# EAGLE design concentrator (EAGLE 9.6.0)
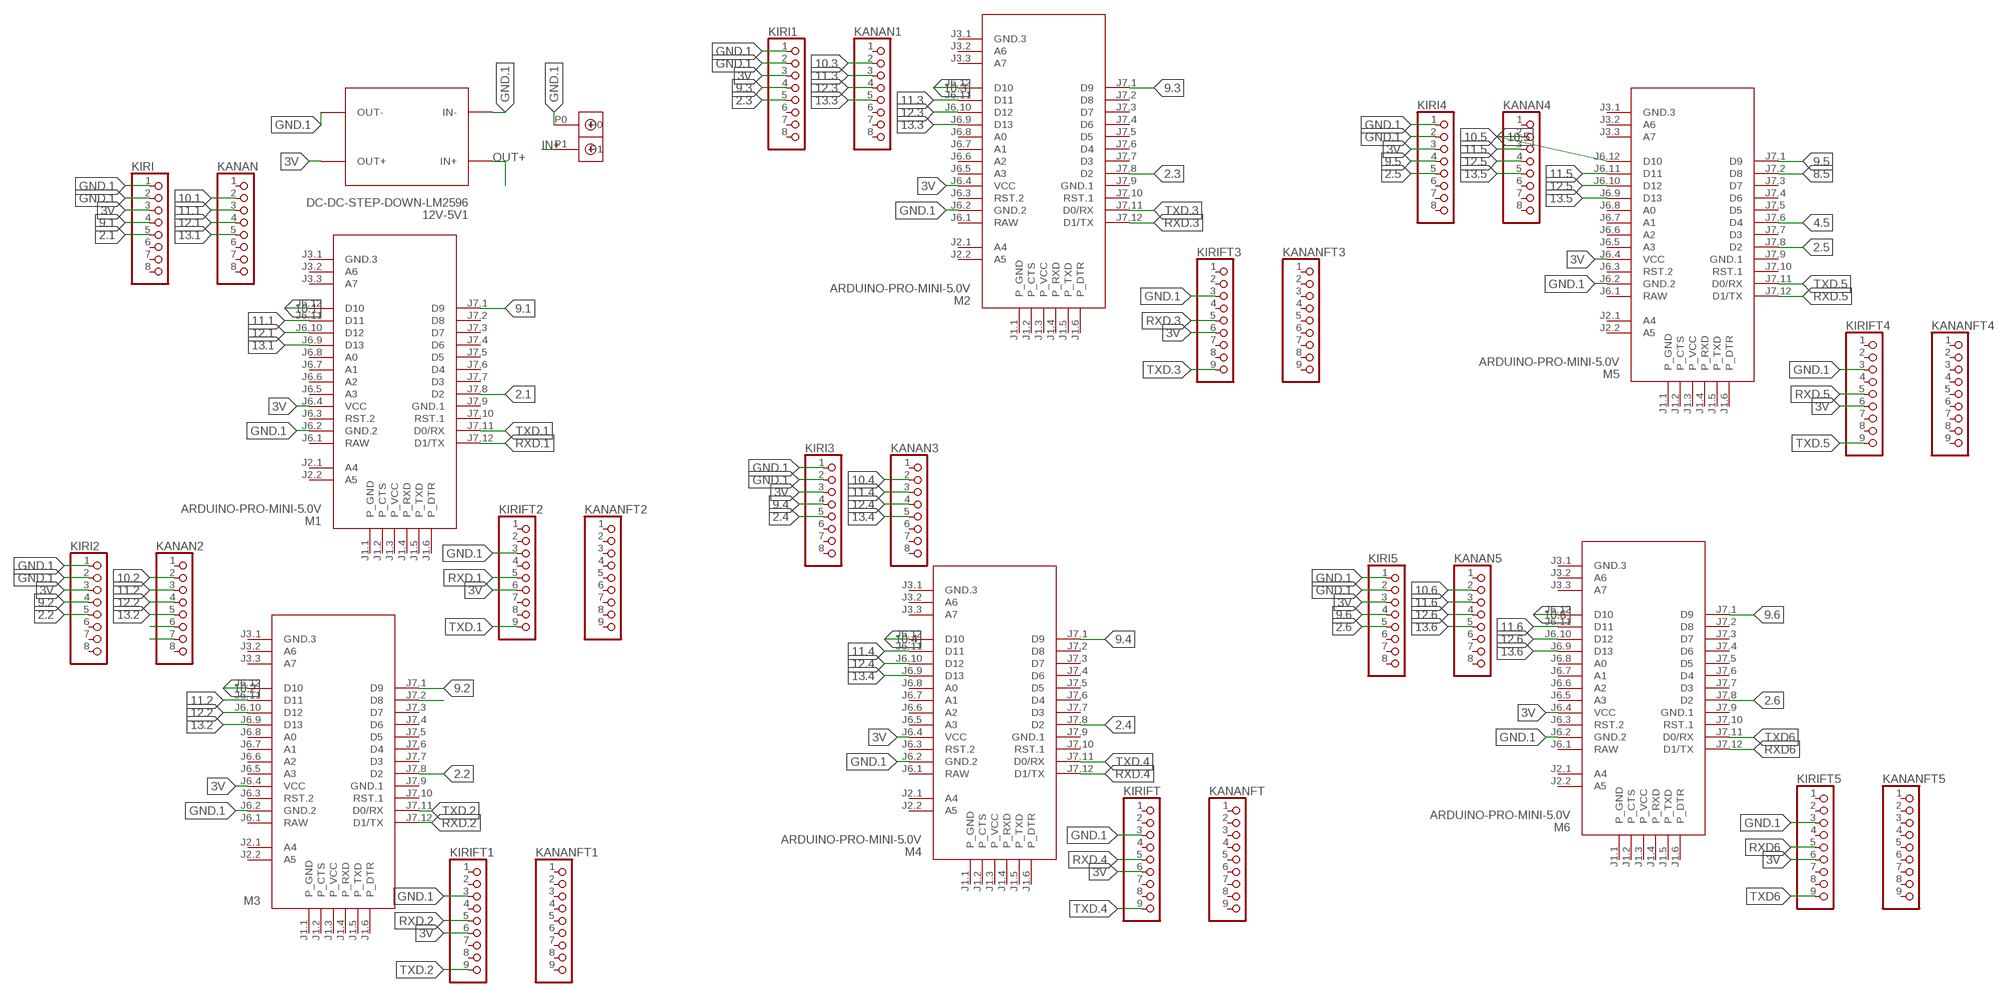
[diagram p0: schematic, sheet 1]

## Parts
12V-5V1  DC-DC-STEP-DOWN-LM2596  [DC-DC-STEP-DOWN-LM2596]
KANAN  PINHD-1X8  [1X08]
KANAN1  PINHD-1X8  [1X08]
KANAN2  PINHD-1X8  [1X08]
KANAN3  PINHD-1X8  [1X08]
KANAN4  PINHD-1X8  [1X08]
KANAN5  PINHD-1X8  [1X08]
KANANFT  PINHD-1X9  [1X09]
KANANFT1  PINHD-1X9  [1X09]
KANANFT2  PINHD-1X9  [1X09]
KANANFT3  PINHD-1X9  [1X09]
KANANFT4  PINHD-1X9  [1X09]
KANANFT5  PINHD-1X9  [1X09]
KIRI  PINHD-1X8  [1X08]
KIRI1  PINHD-1X8  [1X08]
KIRI2  PINHD-1X8  [1X08]
KIRI3  PINHD-1X8  [1X08]
KIRI4  PINHD-1X8  [1X08]
KIRI5  PINHD-1X8  [1X08]
KIRIFT  PINHD-1X9  [1X09]
KIRIFT1  PINHD-1X9  [1X09]
KIRIFT2  PINHD-1X9  [1X09]
KIRIFT3  PINHD-1X9  [1X09]
KIRIFT4  PINHD-1X9  [1X09]
KIRIFT5  PINHD-1X9  [1X09]
M1  ARDUINO-PRO-MINI-5.0V  [ARDUINO-PRO-MINI]
M2  ARDUINO-PRO-MINI-5.0V  [ARDUINO-PRO-MINI]
M3  ARDUINO-PRO-MINI-5.0V  [ARDUINO-PRO-MINI]
M4  ARDUINO-PRO-MINI-5.0V  [ARDUINO-PRO-MINI]
M5  ARDUINO-PRO-MINI-5.0V  [ARDUINO-PRO-MINI]
M6  ARDUINO-PRO-MINI-5.0V  [ARDUINO-PRO-MINI]
U$1  DBCONN-1X2  [DBCONN-1X2]

## Nets
2.1: KIRI.5 M1.J7.8(D2)
2.2: KIRI2.5 M3.J7.8(D2)
2.3: KIRI1.5 M2.J7.8(D2)
2.4: KIRI3.5 M4.J7.8(D2)
2.5: KIRI4.5 M5.J7.8(D2)
2.6: KIRI5.5 M6.J7.8(D2)
3V: 12V-5V1.OUT+ KIRI1.3 KIRI2.3 KIRI3.3 KIRI4.3 KIRI5.3 KIRI.3 KIRIFT1.6 KIRIFT2.6 KIRIFT3.6 KIRIFT4.6 KIRIFT5.6 KIRIFT.6 M1.J6.4(VCC) M2.J6.4(VCC) M3.J6.4(VCC) M4.J6.4(VCC) M5.J6.4(VCC) M6.J6.4(VCC)
4.5: M5.J7.6(D4)
8: M3.J7.2(D8)
8.5: M5.J7.2(D8)
9.1: KIRI.4 M1.J7.1(D9)
9.2: KIRI2.4 M3.J7.1(D9)
9.3: KIRI1.4 M2.J7.1(D9)
9.4: KIRI3.4 M4.J7.1(D9)
9.5: KIRI4.4 M5.J7.1(D9)
9.6: KIRI5.4 M6.J7.1(D9)
10.1: KANAN.2 M1.J6.12(D10)
10.2: KANAN2.2 M3.J6.12(D10)
10.3: KANAN1.2 M2.J6.12(D10)
10.4: KANAN3.2 M4.J6.12(D10)
10.5: KANAN4.2 M5.J6.12(D10)
10.6: KANAN5.2 M6.J6.12(D10)
11.1: KANAN.3 M1.J6.11(D11)
11.2: KANAN2.3 M3.J6.11(D11)
11.3: KANAN1.3 M2.J6.11(D11)
11.4: KANAN3.3 M4.J6.11(D11)
11.5: KANAN4.3 M5.J6.11(D11)
11.6: KANAN5.3 M6.J6.11(D11)
12.1: KANAN.4 M1.J6.10(D12)
12.2: KANAN2.4 M3.J6.10(D12)
12.3: KANAN1.4 M2.J6.10(D12)
12.4: KANAN3.4 M4.J6.10(D12)
12.5: KANAN4.4 M5.J6.10(D12)
12.6: KANAN5.4 M6.J6.10(D12)
13.1: KANAN.5 M1.J6.9(D13)
13.2: KANAN2.5 M3.J6.9(D13)
13.3: KANAN1.5 M2.J6.9(D13)
13.4: KANAN3.5 M4.J6.9(D13)
13.5: KANAN4.5 M5.J6.9(D13)
13.6: KANAN5.5 M6.J6.9(D13)
GND.1: 12V-5V1.IN- 12V-5V1.OUT- KIRI1.1 KIRI1.2 KIRI2.1 KIRI2.2 KIRI3.1 KIRI3.2 KIRI4.1 KIRI4.2 KIRI5.1 KIRI5.2 KIRI.1 KIRI.2 KIRIFT1.3 KIRIFT2.3 KIRIFT3.3 KIRIFT4.3 KIRIFT5.3 KIRIFT.3 M1.J6.2(GND.2) M2.J6.2(GND.2) M3.J6.2(GND.2) M4.J6.2(GND.2) M5.J6.2(GND.2) M6.J6.2(GND.2) U$1.P0
IN+: U$1.P1
N$15: KANAN2.6
N$19: KANAN2.7
OUT+: 12V-5V1.IN+
RXD6: KIRIFT5.5 M6.J7.12(D1/TX)
RXD.1: KIRIFT2.5 M1.J7.12(D1/TX)
RXD.2: KIRIFT1.5 M3.J7.12(D1/TX)
RXD.3: KIRIFT3.5 M2.J7.12(D1/TX)
RXD.4: KIRIFT.5 M4.J7.12(D1/TX)
RXD.5: KIRIFT4.5 M5.J7.12(D1/TX)
TXD6: KIRIFT5.9 M6.J7.11(D0/RX)
TXD.1: KIRIFT2.9 M1.J7.11(D0/RX)
TXD.2: KIRIFT1.9 M3.J7.11(D0/RX)
TXD.3: KIRIFT3.9 M2.J7.11(D0/RX)
TXD.4: KIRIFT.9 M4.J7.11(D0/RX)
TXD.5: KIRIFT4.9 M5.J7.11(D0/RX)
Unconnected: KANAN1.1 KANAN1.6 KANAN1.7 KANAN1.8 KANAN2.1 KANAN2.8 KANAN3.1 KANAN3.6 KANAN3.7 KANAN3.8 KANAN4.1 KANAN4.6 KANAN4.7 KANAN4.8 KANAN5.1 KANAN5.6 KANAN5.7 KANAN5.8 KANAN.1 KANAN.6 KANAN.7 KANAN.8 KANANFT1.1 KANANFT1.2 KANANFT1.3 KANANFT1.4 KANANFT1.5 KANANFT1.6 KANANFT1.7 KANANFT1.8 KANANFT1.9 KANANFT2.1 KANANFT2.2 KANANFT2.3 KANANFT2.4 KANANFT2.5 KANANFT2.6 KANANFT2.7 KANANFT2.8 KANANFT2.9 KANANFT3.1 KANANFT3.2 KANANFT3.3 KANANFT3.4 KANANFT3.5 KANANFT3.6 KANANFT3.7 KANANFT3.8 KANANFT3.9 KANANFT4.1 KANANFT4.2 KANANFT4.3 KANANFT4.4 KANANFT4.5 KANANFT4.6 KANANFT4.7 KANANFT4.8 KANANFT4.9 KANANFT5.1 KANANFT5.2 KANANFT5.3 KANANFT5.4 KANANFT5.5 KANANFT5.6 KANANFT5.7 KANANFT5.8 KANANFT5.9 KANANFT.1 KANANFT.2 KANANFT.3 KANANFT.4 KANANFT.5 KANANFT.6 KANANFT.7 KANANFT.8 KANANFT.9 KIRI1.6 KIRI1.7 KIRI1.8 KIRI2.6 KIRI2.7 KIRI2.8 KIRI3.6 KIRI3.7 KIRI3.8 KIRI4.6 KIRI4.7 KIRI4.8 KIRI5.6 KIRI5.7 KIRI5.8 KIRI.6 KIRI.7 KIRI.8 KIRIFT1.1 KIRIFT1.2 KIRIFT1.4 KIRIFT1.7 KIRIFT1.8 KIRIFT2.1 KIRIFT2.2 KIRIFT2.4 KIRIFT2.7 KIRIFT2.8 KIRIFT3.1 KIRIFT3.2 KIRIFT3.4 KIRIFT3.7 KIRIFT3.8 KIRIFT4.1 KIRIFT4.2 KIRIFT4.4 KIRIFT4.7 KIRIFT4.8 KIRIFT5.1 KIRIFT5.2 KIRIFT5.4 KIRIFT5.7 KIRIFT5.8 KIRIFT.1 KIRIFT.2 KIRIFT.4 KIRIFT.7 KIRIFT.8 M1.J1.1(P_GND) M1.J1.2(P_CTS) M1.J1.3(P_VCC) M1.J1.4(P_RXD) M1.J1.5(P_TXD) M1.J1.6(P_DTR) M1.J2.1(A4) M1.J2.2(A5) M1.J3.1(GND.3) M1.J3.2(A6) M1.J3.3(A7) M1.J6.3(RST.2) M1.J6.5(A3) M1.J6.6(A2) M1.J6.7(A1) M1.J6.8(A0) M1.J7.2(D8) M1.J7.3(D7) M1.J7.4(D6) M1.J7.5(D5) M1.J7.6(D4) M1.J7.7(D3) M1.J7.10(RST.1) M2.J1.1(P_GND) M2.J1.2(P_CTS) M2.J1.3(P_VCC) M2.J1.4(P_RXD) M2.J1.5(P_TXD) M2.J1.6(P_DTR) M2.J2.1(A4) M2.J2.2(A5) M2.J3.1(GND.3) M2.J3.2(A6) M2.J3.3(A7) M2.J6.3(RST.2) M2.J6.5(A3) M2.J6.6(A2) M2.J6.7(A1) M2.J6.8(A0) M2.J7.2(D8) M2.J7.3(D7) M2.J7.4(D6) M2.J7.5(D5) M2.J7.6(D4) M2.J7.7(D3) M2.J7.10(RST.1) M3.J1.1(P_GND) M3.J1.2(P_CTS) M3.J1.3(P_VCC) M3.J1.4(P_RXD) M3.J1.5(P_TXD) M3.J1.6(P_DTR) M3.J2.1(A4) M3.J2.2(A5) M3.J3.1(GND.3) M3.J3.2(A6) M3.J3.3(A7) M3.J6.3(RST.2) M3.J6.5(A3) M3.J6.6(A2) M3.J6.7(A1) M3.J6.8(A0) M3.J7.3(D7) M3.J7.4(D6) M3.J7.5(D5) M3.J7.6(D4) M3.J7.7(D3) M3.J7.10(RST.1) M4.J1.1(P_GND) M4.J1.2(P_CTS) M4.J1.3(P_VCC) M4.J1.4(P_RXD) M4.J1.5(P_TXD) M4.J1.6(P_DTR) M4.J2.1(A4) M4.J2.2(A5) M4.J3.1(GND.3) M4.J3.2(A6) M4.J3.3(A7) M4.J6.3(RST.2) M4.J6.5(A3) M4.J6.6(A2) M4.J6.7(A1) M4.J6.8(A0) M4.J7.2(D8) M4.J7.3(D7) M4.J7.4(D6) M4.J7.5(D5) M4.J7.6(D4) M4.J7.7(D3) M4.J7.10(RST.1) M5.J1.1(P_GND) M5.J1.2(P_CTS) M5.J1.3(P_VCC) M5.J1.4(P_RXD) M5.J1.5(P_TXD) M5.J1.6(P_DTR) M5.J2.1(A4) M5.J2.2(A5) M5.J3.1(GND.3) M5.J3.2(A6) M5.J3.3(A7) M5.J6.3(RST.2) M5.J6.5(A3) M5.J6.6(A2) M5.J6.7(A1) M5.J6.8(A0) M5.J7.3(D7) M5.J7.4(D6) M5.J7.5(D5) M5.J7.7(D3) M5.J7.10(RST.1) M6.J1.1(P_GND) M6.J1.2(P_CTS) M6.J1.3(P_VCC) M6.J1.4(P_RXD) M6.J1.5(P_TXD) M6.J1.6(P_DTR) M6.J2.1(A4) M6.J2.2(A5) M6.J3.1(GND.3) M6.J3.2(A6) M6.J3.3(A7) M6.J6.3(RST.2) M6.J6.5(A3) M6.J6.6(A2) M6.J6.7(A1) M6.J6.8(A0) M6.J7.2(D8) M6.J7.3(D7) M6.J7.4(D6) M6.J7.5(D5) M6.J7.6(D4) M6.J7.7(D3) M6.J7.10(RST.1)

## Power pins joined to a net without a drawn wire
1: M1.J6.1(RAW) M2.J6.1(RAW) M3.J6.1(RAW) M4.J6.1(RAW) M5.J6.1(RAW) M6.J6.1(RAW)
GND.1: M1.J7.9(GND.1) M2.J7.9(GND.1) M3.J7.9(GND.1) M4.J7.9(GND.1) M5.J7.9(GND.1) M6.J7.9(GND.1)

## Library data of the parts
12V-5V1 = diy-modules:DC-DC-STEP-DOWN-LM2596: DC/DC Step-Down Regulator based on LM2596-ADJ chip LM2596 datasheet available here: http://www.ti.com/lit/ds/symlink/lm2596.pdf Click here to find device on ebay.com <http://www.ebay.com/sch/lm2596+power+regulator>
KANAN KANAN1-KANAN5 KIRI KIRI1-KIRI5 = pinhead:PINHD-1X8: PIN HEADER
KANANFT KANANFT1-KANANFT5 KIRIFT KIRIFT1-KIRIFT5 = pinhead:PINHD-1X9: PIN HEADER
M1-M6 = diy-modules:ARDUINO-PRO-MINI-*: Arduino Pro Mini and compatible devices More details available here: https://www.arduino.cc/en/Main/ArduinoBoardProMini Click here to find device on ebay.com <http://www.ebay.com/sch/arduino+pro+mini>
U$1 = Terminal Block Connector:DBCONN-1X2

## Board
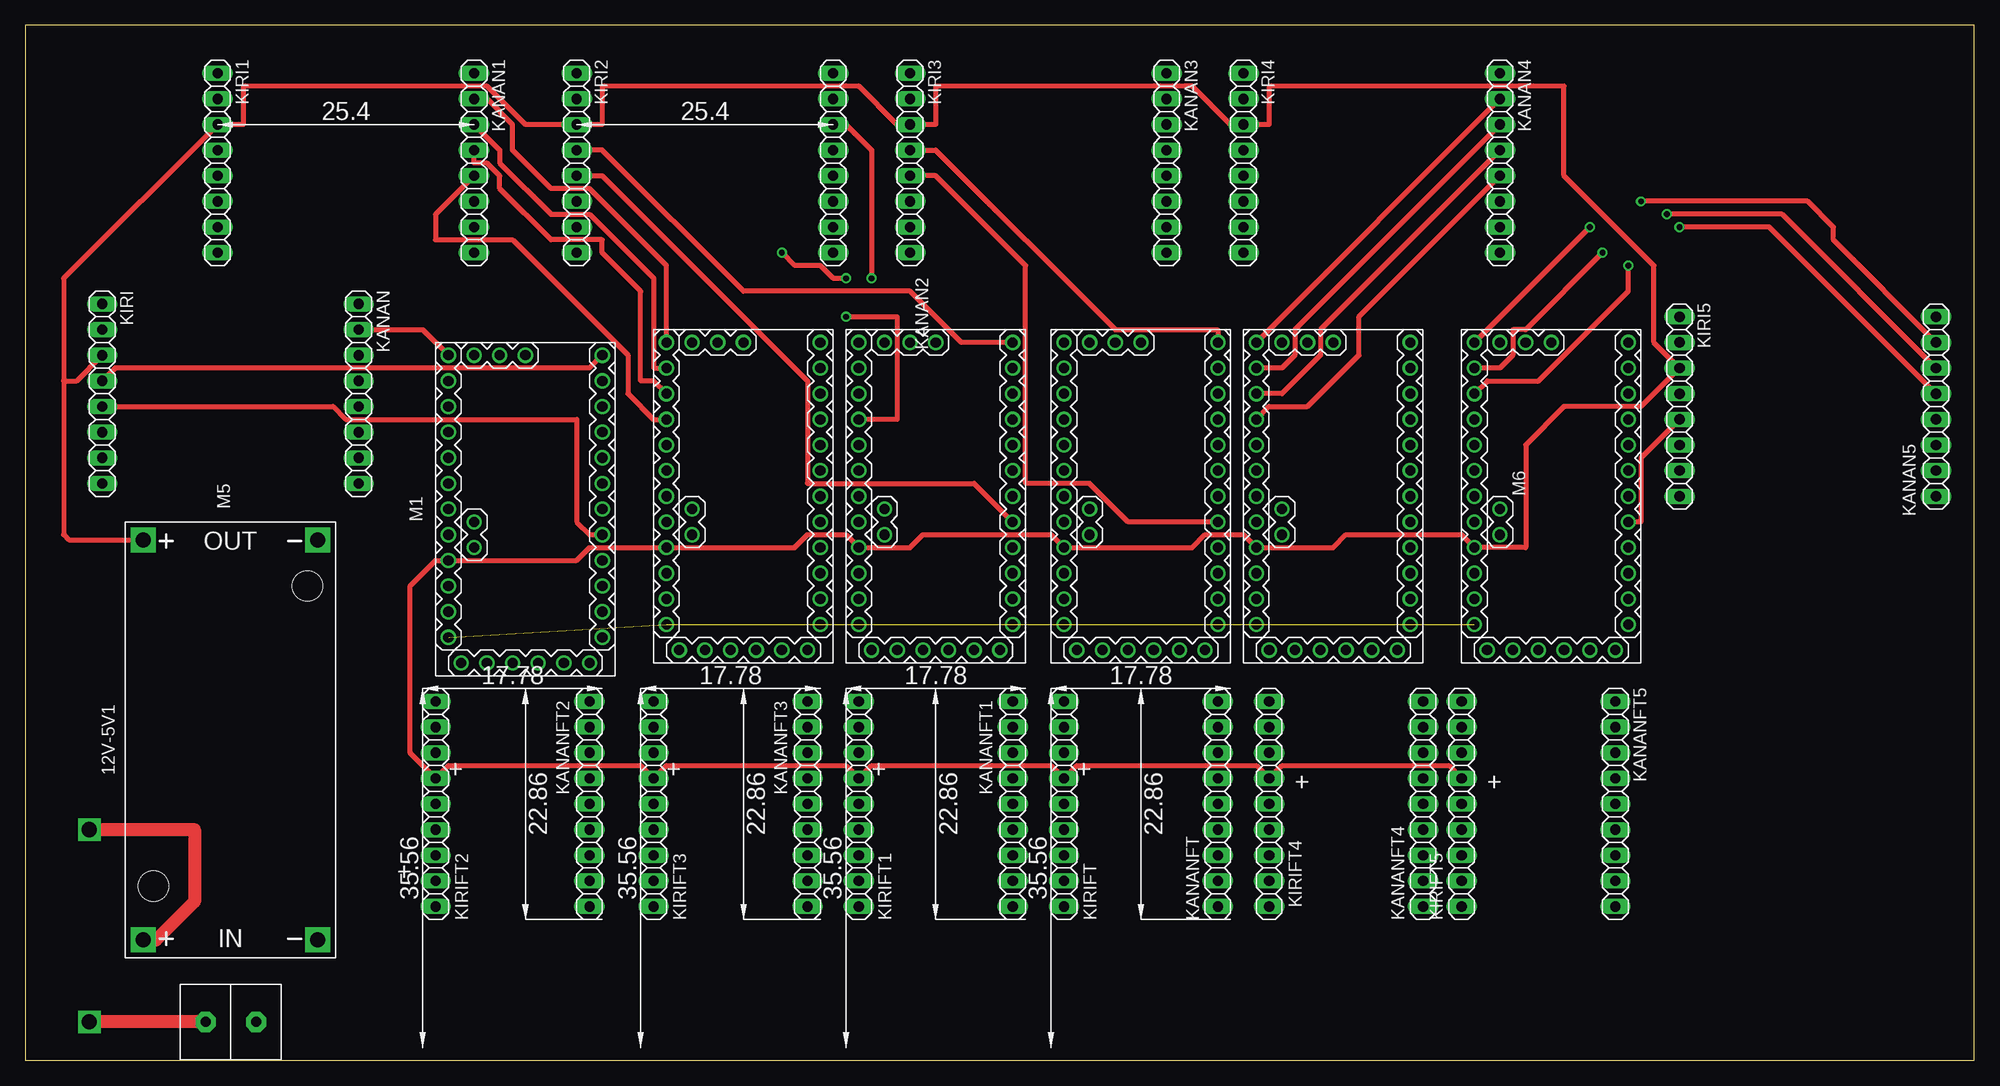
[diagram p1: board, top side]
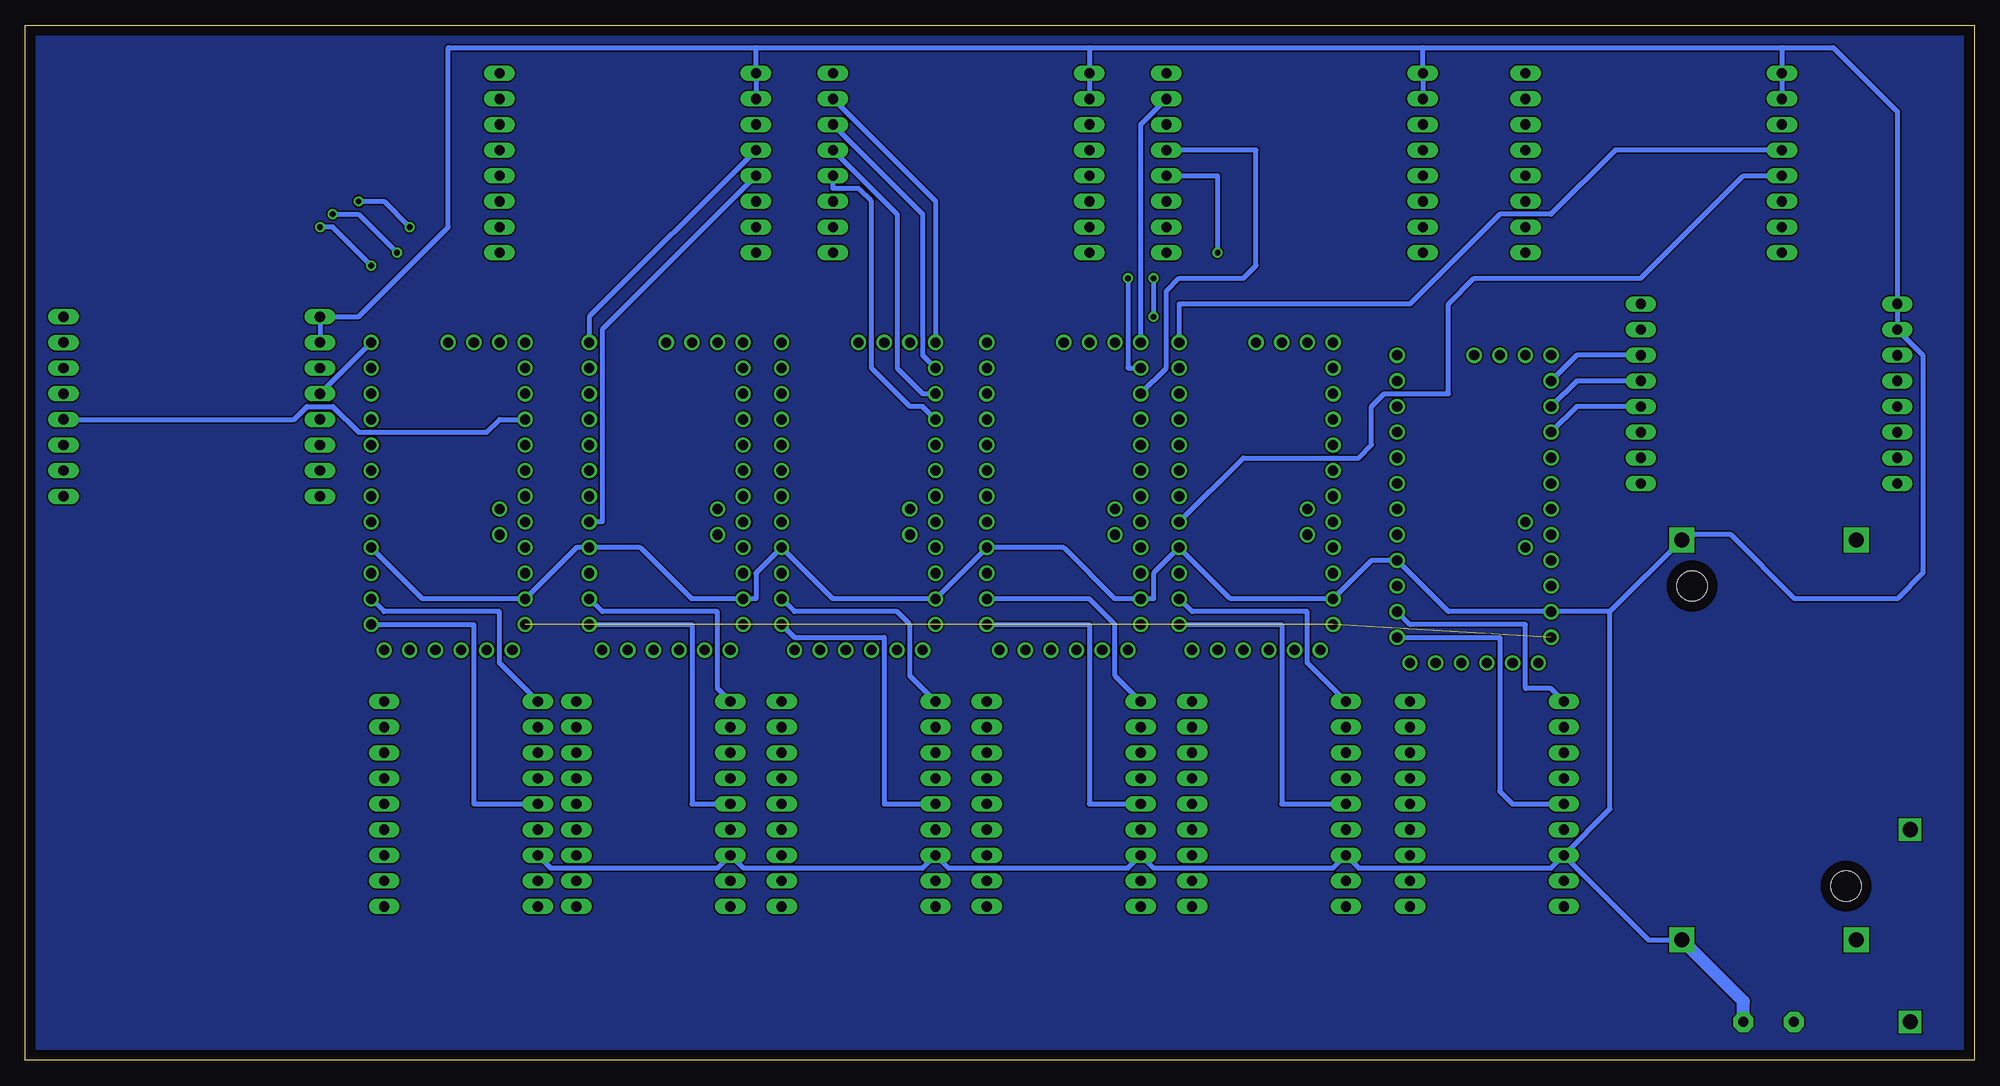
[diagram p2: board, bottom side, seen from below]

Size 193.02 x 102.54 mm. Coordinates in mm from the lower left corner, seen from the top.
Outline: 0,0 193.02,0 193.02,102.54 0,102.54 0,0
Copper layers (1*16): Top 0.035mm / dielectric 1.5mm / Bottom 0.035mm
Design rules "default *": minimum track width 6mil, minimum drill 0.58mm, track to track 6mil, track to pad 6mil, pad to pad 6mil, via to via 6mil, smd to smd 6mil, copper to edge 40mil, drill to drill 6mil, minimum pad ring 10mil, minimum via ring 8mil, stop-mask expansion 4mil, vias tented up to drill 0mil, thermal gap 10mil

### Footprints (pad centres in the part's own frame; a part is rotated, then mirrored left to right if it is on the bottom)
DC-DC-STEP-DOWN-LM2596 = drill 1.5 pad 2.5 square: IN+ -19.812,8.636; IN- -19.812,-8.636; OUT+ 19.812,8.636; OUT- 19.812,-8.636 | hole 3: -14.478,7.62; 15.24,-7.62
1X08 = drill 1.016 long: 1 -8.89,0; 2 -6.35,0; 3 -3.81,0; 4 -1.27,0; 5 1.27,0; 6 3.81,0; 7 6.35,0; 8 8.89,0
1X09 = drill 1.016 long: 1 -10.16,0; 2 -7.62,0; 3 -5.08,0; 4 -2.54,0; 5 0,0; 6 2.54,0; 7 5.08,0; 8 7.62,0; 9 10.16,0
ARDUINO-PRO-MINI = drill 1: J1.1 -15.24,6.35; J1.2 -15.24,3.81; J1.3 -15.24,1.27; J1.4 -15.24,-1.27; J1.5 -15.24,-3.81; J1.6 -15.24,-6.35; J2.1 -1.27,5.08; J2.2 -3.81,5.08; J3.1 15.24,0; J3.2 15.24,2.54; J3.3 15.24,5.08; J6.1 -12.7,7.62; J6.2 -10.16,7.62; J6.3 -7.62,7.62; J6.4 -5.08,7.62; J6.5 -2.54,7.62; J6.6 0,7.62; J6.7 2.54,7.62; J6.8 5.08,7.62; J6.9 7.62,7.62; J6.10 10.16,7.62; J6.11 12.7,7.62; J6.12 15.24,7.62; J7.1 15.24,-7.62; J7.2 12.7,-7.62; J7.3 10.16,-7.62; J7.4 7.62,-7.62; J7.5 5.08,-7.62; J7.6 2.54,-7.62; J7.7 0,-7.62; J7.8 -2.54,-7.62; J7.9 -5.08,-7.62; J7.10 -7.62,-7.62; J7.11 -10.16,-7.62; J7.12 -12.7,-7.62
DBCONN-1X2 = drill 1 pad 2 octagon: P0 -2.54,0; P1 2.46,0

### Placement (x,y rotation side)
12V-5V1  20.32,31.75 90 top
KANAN  33.02,66.04 270 top
KANAN1  44.45,88.9 270 top
KANAN2  80.01,88.9 270 top
KANAN3  113.03,88.9 270 top
KANAN4  146.05,88.9 270 top
KANAN5  189.23,64.77 270 top
KANANFT  118.11,25.4 90 top
KANANFT1  97.79,25.4 270 top
KANANFT2  55.88,25.4 270 top
KANANFT3  77.47,25.4 270 top
KANANFT4  138.43,25.4 90 top
KANANFT5  157.48,25.4 270 top
KIRI  7.62,66.04 270 top
KIRI1  19.05,88.9 270 top
KIRI2  54.61,88.9 270 top
KIRI3  87.63,88.9 270 top
KIRI4  120.65,88.9 270 top
KIRI5  163.83,64.77 270 top
KIRIFT  102.87,25.4 90 top
KIRIFT1  82.55,25.4 90 top
KIRIFT2  40.64,25.4 90 top
KIRIFT3  62.23,25.4 90 top
KIRIFT4  123.19,25.4 90 top
KIRIFT5  142.24,25.4 90 top
M1  49.53,54.61 90 top
M2  71.12,55.88 90 top
M3  90.17,55.88 90 top
M4  110.49,55.88 90 top
M5  129.54,55.88 90 top
M6  151.13,55.88 90 top
U$1  20.32,3.81 180 top

### Tracks (layer width: path | path; a pad name or v marks a point on that pad's centre or on a via)
1  (5 unrouted)
2.1
  Top 0.508: KIRI.5 30.48,64.77 31.75,63.5 54.61,63.5 54.61,53.34 55.88,52.07 M1.J7.8
2.2
  Top 0.508: KIRI2.5 57.15,87.63 77.47,67.31 77.47,57.15 93.98,57.15 M3.J7.8
2.3
  Bottom 0.508: M2.J7.8 72.39,59.69 60.96,59.69 59.69,60.96 59.69,64.77 58.42,66.04 52.07,66.04 52.07,74.93 49.53,77.47 33.02,77.47 22.86,87.63 KIRI1.5
2.4
  Top 0.508: M4.J7.8 109.22,53.34 105.41,57.15 99.06,57.15 99.06,78.74 90.17,87.63 KIRI3.5
2.5
  Bottom 0.508: KIRI4.5 135.89,72.39 135.89,53.34 M5.J7.8
2.6
  Top 0.508: KIRI5.5 160.02,59.69 160.02,53.34 M6.J7.8
3V
  Top 0.508: 3.81,67.31 3.81,77.47 KIRI1.3 21.59,92.71 21.59,96.52 45.72,96.52 49.53,92.71 KIRI2.3 57.15,92.71 57.15,96.52 82.55,96.52 86.36,92.71 KIRI3.3 90.17,92.71 90.17,96.52 115.57,96.52 119.38,92.71 KIRI4.3 123.19,92.71 123.19,96.52 152.4,96.52 152.4,87.63 161.29,78.74 161.29,71.12 KIRI5.3 160.02,64.77 152.4,64.77 148.59,60.96 148.59,50.8 M6.J6.4 142.24,52.07 130.81,52.07 129.54,50.8 M5.J6.4 120.65,52.07 116.84,52.07 115.57,50.8 M4.J6.4 101.6,52.07 88.9,52.07 87.63,50.8 M3.J6.4 81.28,52.07 77.47,52.07 76.2,50.8 M2.J6.4 55.88,50.8 54.61,49.53 M1.J6.4 40.64,49.53 38.1,46.99 38.1,30.48 KIRIFT2.6 41.91,29.21 60.96,29.21 KIRIFT3.6 63.5,29.21 81.28,29.21 KIRIFT1.6 83.82,29.21 101.6,29.21 KIRIFT.6 104.14,29.21 121.92,29.21 KIRIFT4.6 124.46,29.21 140.97,29.21 KIRIFT5.6 | 3.81,67.31 5.08,67.31 KIRI.3 | 3.81,67.31 3.81,52.07 4.32,51.56 12V-5V1.OUT+
9.1
  Top 0.508: KIRI.4 8.89,68.58 55.88,68.58 M1.J7.1
9.2
  Top 0.508: M3.J7.1 92.71,71.12 87.63,76.2 71.12,76.2 57.15,90.17 KIRI2.4
9.3
  Bottom 0.508: KIRI1.4 35.56,90.17 41.91,83.82 46.99,83.82 55.88,74.93 78.74,74.93 M2.J7.1
9.4
  Top 0.508: KIRI3.4 90.17,90.17 107.95,72.39 118.11,72.39 M4.J7.1
9.5
  Bottom 0.508: KIRI4.4 137.16,73.66 M5.J7.1
9.6
  Bottom 0.508: KIRI5.4 M6.J7.1
10.1
  Top 0.508: KANAN.2 39.37,72.39 M1.J6.12
10.2
  Bottom 0.508: KANAN2.2 82.55,92.71 M3.J6.12
10.3
  Top 0.508: M2.J6.12 63.5,78.74 55.88,86.36 52.07,86.36 48.26,90.17 48.26,92.71 45.72,95.25 KANAN1.2
10.4
  Bottom 0.508: KANAN3.2 102.87,85.09 M4.J6.12
10.5
  Top 0.508: KANAN4.2 M5.J6.12
10.6  (via drill 0.58)
  Top 0.508: KANAN5.2 179.07,81.28 179.07,82.55 176.53,85.09 v160.02,85.09 | v154.94,82.55 M6.J6.12
  Bottom 0.508: v160.02,85.09 157.48,85.09 v154.94,82.55
11.1
  Bottom 0.508: KANAN.3 39.37,69.85 M1.J6.11
11.2  (via drill 0.58)
  Top 0.508: KANAN2.3 81.28,92.71 83.82,90.17 v83.82,77.47
  Bottom 0.508: v83.82,77.47 83.82,68.58 M3.J6.11
11.3
  Top 0.508: KANAN1.3 46.99,90.17 46.99,88.9 52.07,83.82 55.88,83.82 62.23,77.47 62.23,68.58 M2.J6.11
11.4
  Bottom 0.508: KANAN3.3 104.14,83.82 104.14,69.85 M4.J6.11
11.5
  Top 0.508: KANAN4.3 125.73,72.39 125.73,69.85 124.46,68.58 M5.J6.11
11.6  (via drill 0.58)
  Top 0.508: KANAN5.3 173.99,83.82 v162.56,83.82 | v156.21,80.01 148.59,72.39 147.32,72.39 147.32,69.85 146.05,68.58 M6.J6.11
  Bottom 0.508: v162.56,83.82 160.02,83.82 v156.21,80.01
12.1
  Bottom 0.508: KANAN.4 39.37,67.31 M1.J6.10
12.2
  Bottom 0.508: M3.J6.10 80.01,68.58 80.01,76.2 78.74,77.47 72.39,77.47 71.12,78.74 71.12,90.17 KANAN2.4
12.3
  Top 0.508: M2.J6.10 62.23,67.31 60.96,67.31 60.96,76.2 57.15,80.01 57.15,81.28 52.07,81.28 46.99,86.36 46.99,87.63 45.72,88.9 44.45,88.9 KANAN1.4
12.4
  Bottom 0.508: KANAN3.4 106.68,83.82 106.68,68.58 104.14,66.04 M4.J6.10
12.5
  Top 0.508: KANAN4.4 128.27,72.39 128.27,69.85 124.46,66.04 M5.J6.10
12.6  (via drill 0.58)
  Top 0.508: KANAN5.4 172.72,82.55 v163.83,82.55 | M6.J6.10 144.78,67.31 149.86,67.31 158.75,76.2 v158.75,78.74
  Bottom 0.508: v163.83,82.55 162.56,82.55 v158.75,78.74
13.1
  Bottom 0.508: KANAN.5 39.37,64.77 M1.J6.9
13.2  (via drill 0.58)
  Top 0.508: v74.93,80.01 76.2,78.74 78.74,78.74 80.01,77.47 v81.28,77.47 | v81.28,73.66 86.36,73.66 86.36,63.5 M3.J6.9
  Bottom 0.508: KANAN2.5 74.93,87.63 v74.93,80.01 | v81.28,77.47 v81.28,73.66
13.3
  Top 0.508: KANAN1.5 40.64,83.82 40.64,81.28 48.26,81.28 59.69,69.85 59.69,66.04 62.23,63.5 M2.J6.9
13.4
  Bottom 0.508: M4.J6.9 104.14,64.77 105.41,64.77 109.22,68.58 109.22,85.09 110.49,86.36 113.03,86.36 KANAN3.5
13.5
  Top 0.508: M5.J6.9 123.19,64.77 127,64.77 132.08,69.85 132.08,73.66 KANAN4.5
13.6
  Bottom 0.508: KANAN5.5 166.37,63.5 165.1,64.77 162.56,64.77 160.02,62.23 147.32,62.23 146.05,63.5 M6.J6.9
GND
  pour Bottom: 0,0 193.04,0 193.04,102.87 0,102.87
GND.1
  Bottom 0.508: KIRI1.2 KIRI1.1 19.05,100.33 | KIRI2.2 KIRI2.1 54.61,100.33 | KIRI3.2 KIRI3.1 87.63,100.33 | KIRI4.2 KIRI4.1 120.65,100.33 | KIRI5.2 KIRI5.1 160.02,73.66 151.13,82.55 151.13,100.33 120.65,100.33 | 120.65,100.33 87.63,100.33 | 87.63,100.33 54.61,100.33 | 54.61,100.33 19.05,100.33 | 19.05,100.33 13.97,100.33 7.62,93.98 KIRI.1 KIRI.2 5.08,69.85 5.08,48.26 7.62,45.72 17.78,45.72 24.13,52.07 29.21,52.07 29.21,51.82 12V-5V1.OUT- 36.07,44.45 | 36.07,44.45 M1.J6.2 52.07,44.45 M1.J7.9 59.69,49.53 M2.J6.2 73.66,45.72 M2.J7.9 81.28,48.26 81.28,45.72 M3.J6.2 85.09,45.72 90.17,50.8 M3.J7.9 M4.J6.2 113.03,45.72 M4.J7.9 120.65,48.26 120.65,45.72 M5.J6.2 127,45.72 132.08,50.8 M5.J7.9 138.43,50.8 M6.J6.2 153.67,45.72 M6.J7.9 | KIRIFT5.3 140.97,19.05 124.46,19.05 KIRIFT4.3 121.92,19.05 104.14,19.05 KIRIFT.3 101.6,19.05 83.82,19.05 KIRIFT1.3 81.28,19.05 63.5,19.05 KIRIFT3.3 60.96,19.05 41.91,19.05 KIRIFT2.3 | KIRIFT2.3 32.26,11.94 12V-5V1.IN- | KIRIFT2.3 36.07,24.89 36.07,44.45
  Bottom 1.27: U$1.P0 22.86,5.84 12V-5V1.IN-
IN+  (via drill 1.5)
  Top 1.27: U$1.P1 v6.35,3.81
OUT+  (via drill 1.5)
  Top 1.27: 12V-5V1.IN+ 12.95,11.94 16.76,15.75 16.76,22.86 v6.35,22.86
RXD6
  Bottom 0.508: M6.J7.12 148.59,43.18 148.59,25.4 KIRIFT5.5
RXD.1
  Bottom 0.508: M1.J7.12 46.99,41.91 46.99,26.67 45.72,25.4 KIRIFT2.5
RXD.2
  Bottom 0.508: KIRIFT1.5 87.63,25.4 87.63,43.18 M3.J7.12
RXD.3
  Bottom 0.508: M2.J7.12 68.58,43.18 68.58,25.4 KIRIFT3.5
RXD.4
  Bottom 0.508: M4.J7.12 116.84,41.91 107.95,41.91 107.95,25.4 KIRIFT.5
RXD.5
  Bottom 0.508: M5.J7.12 127,43.18 127,25.4 KIRIFT4.5
TXD6
  Bottom 0.508: KIRIFT5.9 146.05,39.37 146.05,44.45 157.48,44.45 M6.J7.11
TXD.1
  Bottom 0.508: KIRIFT2.9 41.91,36.83 44.45,36.83 44.45,43.18 55.88,43.18 M1.J7.11
TXD.2
  Bottom 0.508: KIRIFT1.9 85.09,38.1 85.09,43.18 87.63,45.72 M3.J7.11
TXD.3
  Bottom 0.508: KIRIFT3.9 66.04,39.37 66.04,44.45 77.47,44.45 M2.J7.11
TXD.4
  Bottom 0.508: KIRIFT.9 105.41,38.1 105.41,43.18 106.68,44.45 116.84,44.45 M4.J7.11
TXD.5
  Bottom 0.508: KIRIFT4.9 124.46,36.83 124.46,44.45 135.89,44.45 M5.J7.11

### Text on the board
tPlace: + | + | + | + | + | + | +